# Altium schematic sheet 03_MCU.SchDoc
size B; SheetNumber: 3; SheetTotal: 6
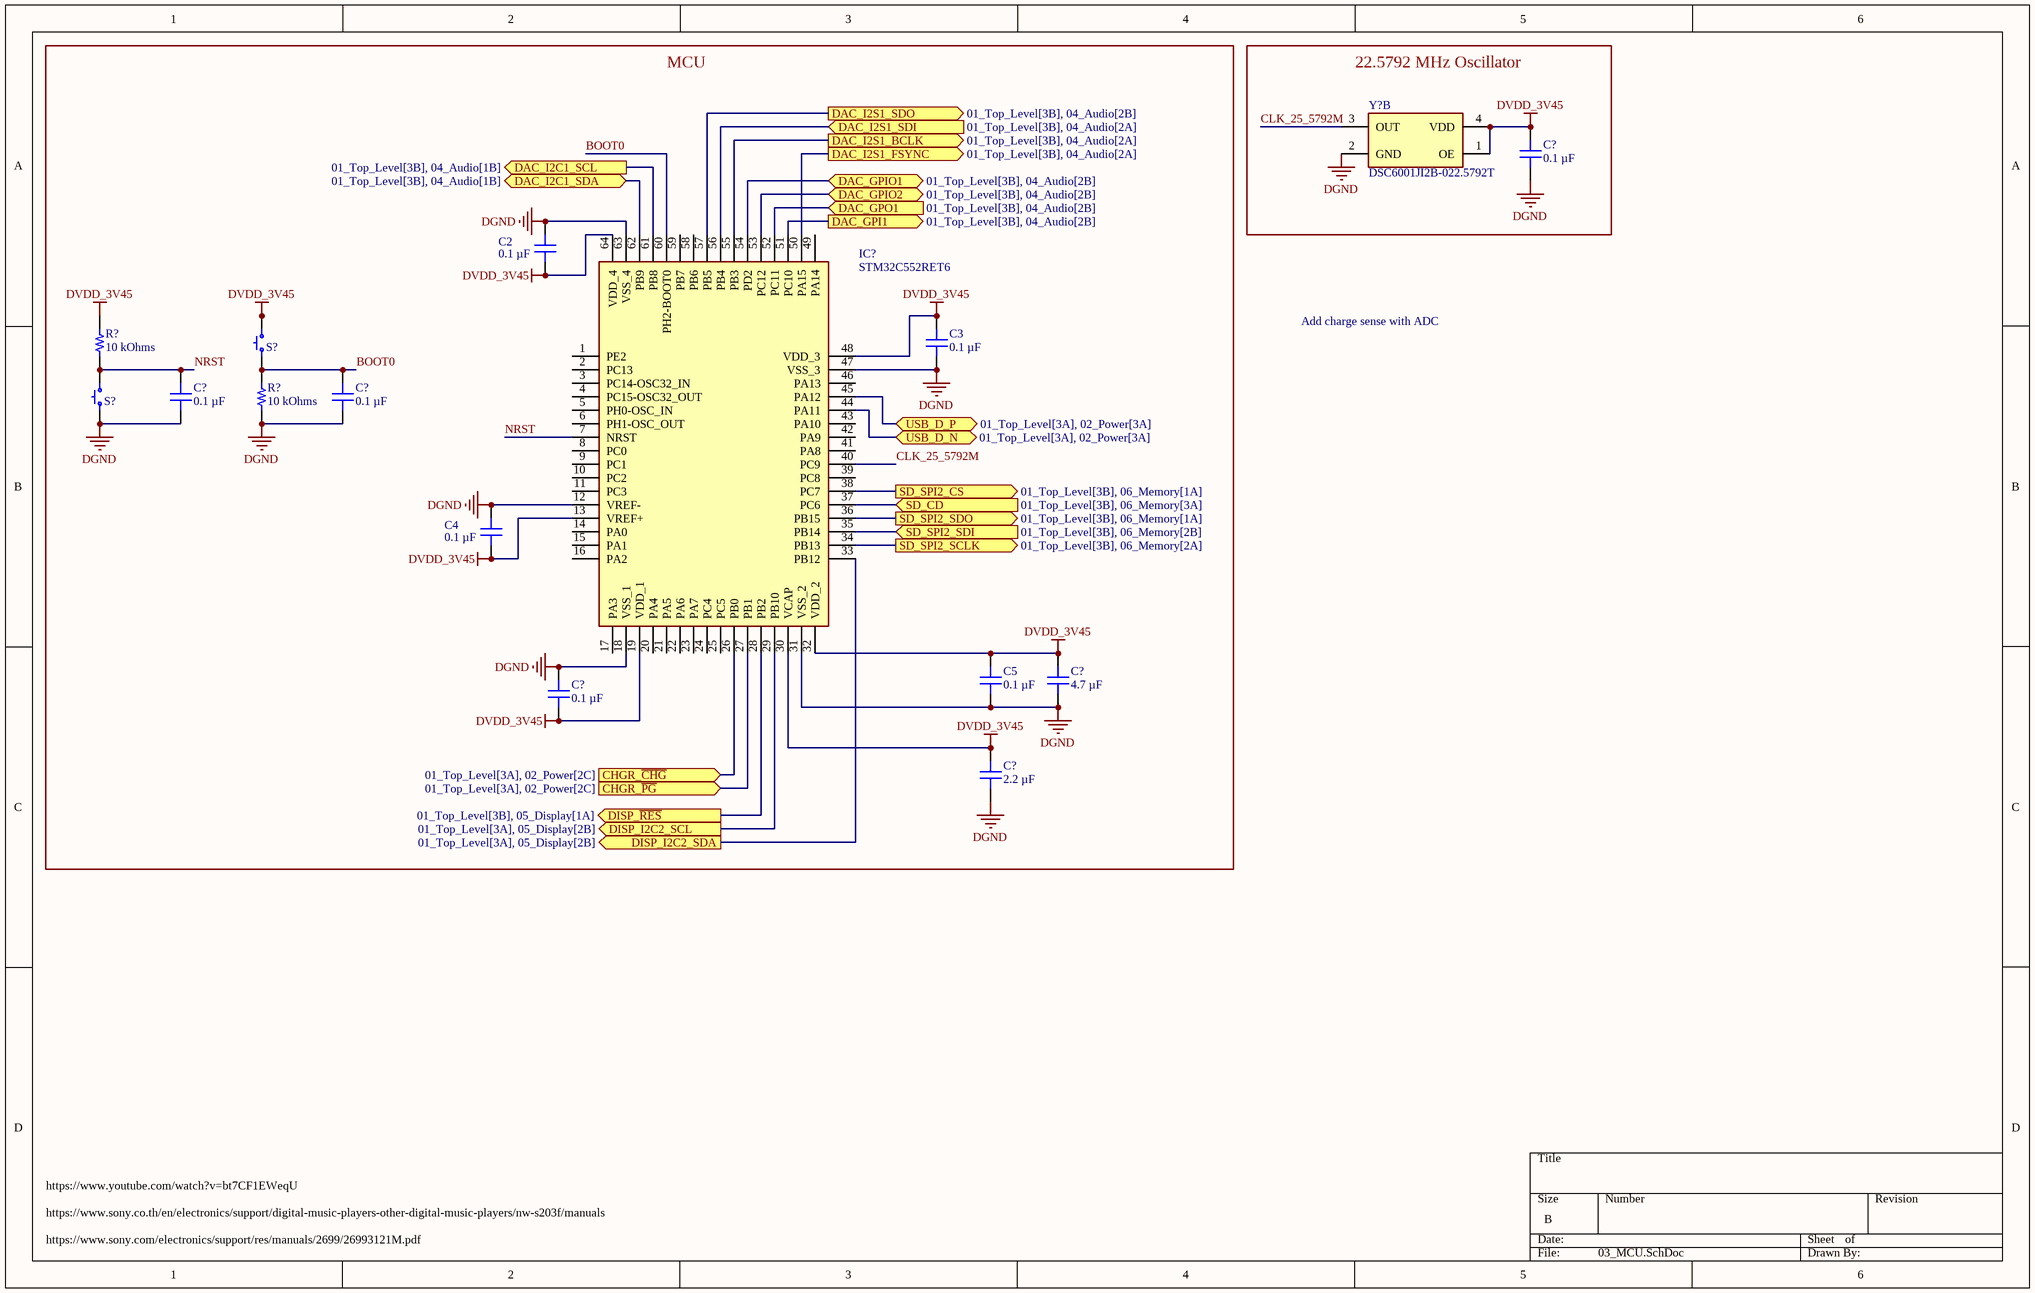
[diagram p0: 03_MCU.SchDoc]

## Parts
(Parts that share a designator on the sheet are numbered #1, #2 ... from top to bottom, then left to right.)
C2  0.1 µF  [CAP 0402_1005]
C3  0.1 µF  [CAP 0402_1005]
C4  0.1 µF  [CAP 0402_1005]
C5  0.1 µF  [CAP 0402_1005]
C?#1  0.1 µF  [CAP 0402_1005]
C?#2  0.1 µF  [CAP 0402_1005]
C?#3  0.1 µF  [CAP 0402_1005]
C?#4  4.7 µF  [CAP 0805_2012]
C?#5  0.1 µF  [CAP 0402_1005]
C?#6  2.2 µF  [CAP 0603_1608]
IC?  STM32C552RET6  [QFP50P1200X1200X160-64N]
R?#1  10 kOhms  [RES 0402_1005]
R?#2  10 kOhms  [RES 0402_1005]
S?#1  SKSVCBE010  [SKSVCBE010]  (value not drawn)
S?#2  SKSVCBE010  [SKSVCBE010]  (value not drawn)
Y?  DSC6001JI2B-022.5792T  [4-VLGA-2.5X2]  (part B of 2)

## Blocks framed on the sheet
MCU: C2-C5 C?#2-C?#6 IC? R?#1 R?#2 S?#1 S?#2
22.5792 MHz Oscillator: C?#1 Y?

## Ports
CHGR_~{CHG} (in, see 01_Top_Level[3A], 02_Power[2C]), CHGR_~{PG} (in, see 01_Top_Level[3A], 02_Power[2C]), DAC_GPI1 (out, see 01_Top_Level[3B], 04_Audio[2B]), DAC_GPIO1 (bidir, see 01_Top_Level[3B], 04_Audio[2B]), DAC_GPIO2 (bidir, see 01_Top_Level[3B], 04_Audio[2B]), DAC_GPO1 (in, see 01_Top_Level[3B], 04_Audio[2B]), DAC_I2C1_SCL (out, see 01_Top_Level[3B], 04_Audio[1B]), DAC_I2C1_SDA (bidir, see 01_Top_Level[3B], 04_Audio[1B]), DAC_I2S1_BCLK (out, see 01_Top_Level[3B], 04_Audio[2A]), DAC_I2S1_FSYNC (out, see 01_Top_Level[3B], 04_Audio[2A]), DAC_I2S1_SDI (in, see 01_Top_Level[3B], 04_Audio[2A]), DAC_I2S1_SDO (out, see 01_Top_Level[3B], 04_Audio[2B]), DISP_I2C2_SCL (out, see 01_Top_Level[3A], 05_Display[2B]), DISP_I2C2_SDA (out, see 01_Top_Level[3A], 05_Display[2B]), DISP_~{RES} (out, see 01_Top_Level[3B], 05_Display[1A]), SD_CD (in, see 01_Top_Level[3B], 06_Memory[3A]), SD_SPI2_CS (out, see 01_Top_Level[3B], 06_Memory[1A]), SD_SPI2_SCLK (out, see 01_Top_Level[3B], 06_Memory[2A]), SD_SPI2_SDI (in, see 01_Top_Level[3B], 06_Memory[2B]), SD_SPI2_SDO (out, see 01_Top_Level[3B], 06_Memory[1A]), USB_D_N (bidir, see 01_Top_Level[3A], 02_Power[3A]), USB_D_P (bidir, see 01_Top_Level[3A], 02_Power[3A])

## Nets
DGND: C2.1 C3.2 C4.2 C5.2 C?#1.2 C?#2.2 C?#3.2 C?#4.1 C?#5.1 C?#6.1 IC?.12(VREF-) IC?.18(VSS_1) IC?.31(VSS_2) IC?.47(VSS_3) IC?.63(VSS_4) R?#2.1 S?#2.1 S?#2.2 Y?.2(GND)
DVDD_3V45: C2.2 C3.1 C4.1 C5.1 C?#1.1 C?#4.2 C?#5.2 C?#6.2 IC?.13(VREF+) IC?.19(VDD_1) IC?.30(VCAP) IC?.32(VDD_2) IC?.48(VDD_3) IC?.64(VDD_4) R?#1.2 S?#1.3 S?#1.4 Y?.1(OE) Y?.4(VDD)
BOOT0: C?#3.1 IC?.60(PH2-BOOT0) R?#2.2 S?#1.1 S?#1.2
CHGR_~{CHG}: IC?.26(PB0) ; port CHGR_~{CHG}
CHGR_~{PG}: IC?.27(PB1) ; port CHGR_~{PG}
CLK_25_5792M: IC?.40(PC9) Y?.3(OUT)
DAC_GPI1: IC?.51(PC10) ; port DAC_GPI1
DAC_GPIO1: IC?.54(PD2) ; port DAC_GPIO1
DAC_GPIO2: IC?.53(PC12) ; port DAC_GPIO2
DAC_GPO1: IC?.52(PC11) ; port DAC_GPO1
DAC_I2C1_SCL: IC?.61(PB8) ; port DAC_I2C1_SCL
DAC_I2C1_SDA: IC?.62(PB9) ; port DAC_I2C1_SDA
DAC_I2S1_BCLK: IC?.55(PB3) ; port DAC_I2S1_BCLK
DAC_I2S1_FSYNC: IC?.50(PA15) ; port DAC_I2S1_FSYNC
DAC_I2S1_SDI: IC?.56(PB4) ; port DAC_I2S1_SDI
DAC_I2S1_SDO: IC?.57(PB5) ; port DAC_I2S1_SDO
DISP_I2C2_SCL: IC?.29(PB10) ; port DISP_I2C2_SCL
DISP_I2C2_SDA: IC?.33(PB12) ; port DISP_I2C2_SDA
DISP_~{RES}: IC?.28(PB2) ; port DISP_~{RES}
NRST: C?#2.1 IC?.7(NRST) R?#1.1 S?#2.3 S?#2.4
SD_CD: IC?.37(PC6) ; port SD_CD
SD_SPI2_CS: IC?.38(PC7) ; port SD_SPI2_CS
SD_SPI2_SCLK: IC?.34(PB13) ; port SD_SPI2_SCLK
SD_SPI2_SDI: IC?.35(PB14) ; port SD_SPI2_SDI
SD_SPI2_SDO: IC?.36(PB15) ; port SD_SPI2_SDO
USB_D_N: IC?.44(PA11) ; port USB_D_N
USB_D_P: IC?.45(PA12) ; port USB_D_P

Not connected (* = marked no-connect by the designer): IC? 1(PE2) 2(PC13) 3(PC14-OSC32_IN) 4(PC15-OSC32_OUT) 5(PH0-OSC_IN) 6(PH1-OSC_OUT) 8(PC0) 9(PC1) 10(PC2) 11(PC3) 14(PA0) 15(PA1) 16(PA2) 17(PA3) 20(PA4) 21(PA5) 22(PA6) 23(PA7) 24(PC4) 25(PC5) 39(PC8) 41(PA8) 42(PA9) 43(PA10) 46(PA13) 49(PA14) 58(PB6) 59(PB7)

## Notes on the sheet
- Add charge sense with ADC
- https://www.youtube.com/watch?v=bt7CF1EWeqU
- https://www.sony.co.th/en/electronics/support/digital-music-players-other-digital-music-players/nw-s203f/manuals
- https://www.sony.com/electronics/support/res/manuals/2699/26993121M.pdf

## Library data of the parts
C2-C5 C?#1-C?#3 C?#5 = EMF105B7104KVHF: CAP CER 0.1UF 16V X7R 0402; manufacturer: Taiyo Yuden; Tolerance: ±10%; Part Number: EMF105B7104KVHF; Capacitance: 0.1 µF; Applications: Automotive, SMPS Filtering; componentlink1description: Datasheet; componentlink1url: https://ds.yuden.co.jp/TYCOMPAS/ut/detail?pn=EMF105B7104KVHF&u=M; componentlink2description: DigiKey Link; componentlink2url: https://www.digikey.com/en/products/detail/taiyo-yuden/EMF105B7104KVHF/10379129; Device Package: 0402 (1005 Metric); lastupdated: 4/6/2026 7:11:11 PM; Lifecycle Status: Active; Minimum Order: 1; Mounting Type: Surface Mount, MLCC; Operating Temperature: -55°C ~ 125°C; Package / Case: 0402 (1005 Metric); packaging: TapeAndReel; partid: 1868; Part Status: Active; price: 0.01; Ratings: AEC-Q200; series: M; Size / Dimension: 0.039" L x 0.020" W (1.00mm x 0.50mm); Supplier 1: DigiKey; Supplier Part Number 1: 587-6563-1-ND; Temperature Coefficient: X7R; Thickness (Max): 0.022" (0.55mm); value: 0.1 µF; Voltage - Rated: 16V
C?#4 = MSAST21GAB5475KTNA01: CAP CER 4.7UF 25V X5R 0805; manufacturer: Taiyo Yuden; Tolerance: ±10%; Part Number: MSAST21GAB5475KTNA01; Capacitance: 4.7 µF; Applications: SMPS Filtering; componentlink1description: Datasheet; componentlink1url: https://mm.digikey.com/Volume0/opasdata/d220001/medias/docus/5731/MSR01_e.pdf; componentlink2description: DigiKey Link; componentlink2url: https://www.digikey.com/en/products/detail/taiyo-yuden/MSAST21GAB5475KTNA01/16659772; Device Package: 0805 (2012 Metric); lastupdated: 4/6/2026 7:29:35 PM; Lifecycle Status: Active; Minimum Order: 1; Mounting Type: Surface Mount, MLCC; Operating Temperature: -55°C ~ 85°C; Package / Case: 0805 (2012 Metric); packaging: TapeAndReel; partid: 73602; price: 0.02; series: MSAS; Size / Dimension: 0.079" L x 0.049" W (2.00mm x 1.25mm); Supplier 1: DigiKey; Supplier Part Number 1: 587-MSAST21GAB5475KTNA01CT-ND; Temperature Coefficient: X5R; Thickness (Max): 0.055" (1.40mm); value: 4.7 µF; Voltage - Rated: 25V
C?#6 = GRM188R61E225KA12D: CAP CER 2.2UF 25V X5R 0603; manufacturer: Murata Electronics; Tolerance: ±10%; Part Number: GRM188R61E225KA12D; Capacitance: 2.2 µF; Applications: General Purpose; componentlink1description: Datasheet; componentlink1url: https://search.murata.co.jp/Ceramy/image/img/A01X/G101/ENG/GRM188R61E225KA12-01.pdf; componentlink2description: DigiKey Link; componentlink2url: https://www.digikey.com/en/products/detail/murata-electronics/GRM188R61E225KA12D/4905349; Device Package: 0603 (1608 Metric); lastupdated: 4/6/2026 7:23:52 PM; Lifecycle Status: Active; Minimum Order: 1; Mounting Type: Surface Mount, MLCC; Operating Temperature: -55°C ~ 85°C; Package / Case: 0603 (1608 Metric); packaging: TapeAndReel; partid: 2326; Part Status: Active; price: 0.01; series: GRM; Size / Dimension: 0.063" L x 0.031" W (1.60mm x 0.80mm); Supplier 1: DigiKey; Supplier Part Number 1: 490-10731-1-ND; Temperature Coefficient: X5R; Thickness (Max): 0.035" (0.90mm); value: 2.2 µF; Voltage - Rated: 25V
IC? = STM32C552RET6: Integrated Circuit; Manufacturer_Name: STMicroelectronics; Datasheet Link: https://www.st.com/resource/en/datasheet/stm32c551cc.pdf; Height: 1.6mm; Manufacturer_Part_Number: STM32C552RET6; Arrow Part Number: STM32C552RET6; Arrow Price/Stock: https://www.arrow.com/en/products/stm32c552ret6/stmicroelectronics.html?utm_currency=USD&region=nac
R?#1 R?#2 = CRCW040210K0FKEE: RES SMD 10K OHM 1% 1/16W 0402; Manufacturer: Vishay Dale; Power (Watts): 0.063W, 1/16W; Temperature Coefficient: ±100ppm/°C; Part Number: CRCW040210K0FKEE; Value: 10 kOhms; ComponentLink1Description: Datasheet; ComponentLink1URL: http://www.vishay.com/docs/20035/dcrcwe3.pdf; ComponentLink2Description: DigiKey Link; ComponentLink2URL: https://www.digikey.com/en/products/detail/vishay-dale/CRCW040210K0FKEE/5069897; Composition: Thick Film; Device Package: 0402 (1005 Metric); Features: Automotive AEC-Q200; Height - Seated (Max): 0.016" (0.40mm); LastUpdated: 2/9/2024 8:30:20 PM; Lifecycle Status: Active; Minimum Order: 1; Number of Terminations: 2; Operating Temperature: -55°C ~ 155°C; Package / Case: 0402 (1005 Metric); Packaging: CutTape; PartId: 3471; Part Status: Active; Price: 0.01; Ratings: AEC-Q200; Resistance: 10 kOhms; Series: CRCW; Size / Dimension: 0.039" L x 0.020" W (1.00mm x 0.50mm); Supplier 1: DigiKey; Supplier Part Number 1: 541-2954-1-ND; Supplier Device Package: 0402; Tolerance: ±1%
S?#1 S?#2 = SKSVCBE010: Switch; Manufacturer_Name: ALPS Electric; Datasheet Link: https://tech.alpsalpine.com/e/products/detail/SKSVCBE010/; Height: 0.65mm; Manufacturer_Part_Number: SKSVCBE010; Mouser Part Number: 688-SKSVCBE010; Mouser Price/Stock: https://www.mouser.co.uk/ProductDetail/Alps-Alpine/SKSVCBE010?qs=Jm2GQyTW%2Fbim%2FQWWFLRejw%3D%3D; Digikey Link: https://www.digikey.ca/en/products/detail/alps-alpine/SKSVCBE010/26519632
Y? = DSC6001JI2B-022.5792T: 22.5792 MHz XO (Standard) CMOS Oscillator 1.71V ~ 3.63V Enable/Disable 4-VLGA; Base Resonator: MEMS; Frequency Stability: ±25ppm; Current Supply (Max): 1.3mA (Typ); Type: XO (Standard); Frequency: 22.5792 MHz; Function: Enable/Disable; Output: CMOS; Voltage - Supply: 1.71V ~ 3.63V; Operating Temperature: -40°C ~ 85°C; Mounting Type: Surface Mount; Package / Case: 4-VLGA; Supplier Device Package: 4-VLGA (2.5x2); Size / Dimension: 0.098" L x 0.079" W (2.50mm x 2.00mm); Height - Seated (Max): 0.035" (0.89mm); ComponentLink1Description: Datasheet; ComponentLink1URL: https://ww1.microchip.com/downloads/aemDocuments/documents/TCG/ProductDocuments/DataSheets/DSC60xxB-Ultra-Small-Ultra-Low-Power-MEMS-Oscillator-DS20006133.pdf; ComponentLink2Description: DigiKey; ComponentLink2URL: https://www.digikey.ca/en/products/detail/microchip-technology/DSC6001JI2B-022-5792T/22212139; Supplier 1: Avnet; Supplier Part Number 1: DSC6001JI2B-022.5792T